# Altium schematic sheet Headers.SchDoc
size B; SheetNumber: 3; SheetTotal: 3
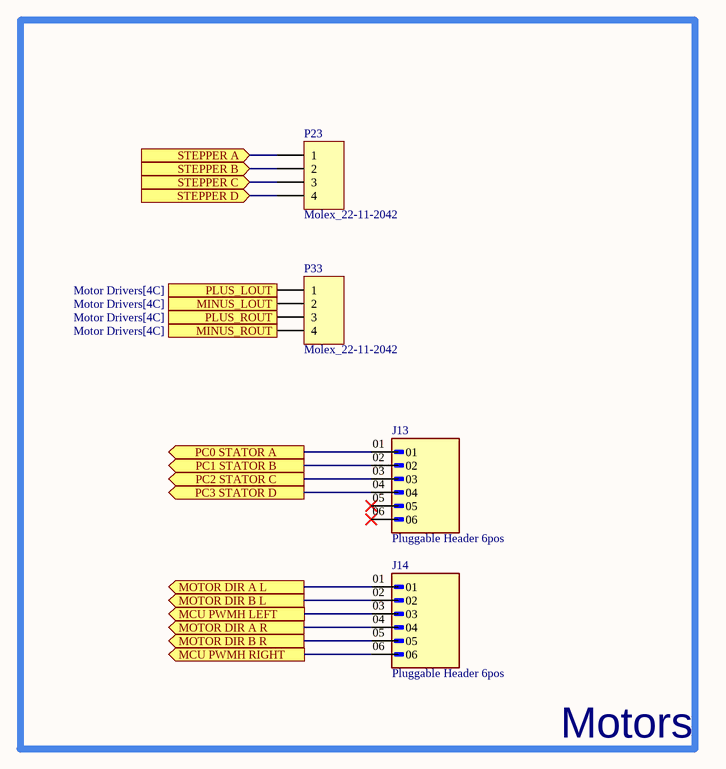
[diagram p0: Headers.SchDoc]

## Parts
J13  Pluggable Header 6pos  [PHOENIX_1757284]
J14  Pluggable Header 6pos  [PHOENIX_1757284]
P23  Molex_22-11-2042  [MOLEX-22-11-2042]
P33  Molex_22-11-2042  [MOLEX-22-11-2042]

## Blocks framed on the sheet
Motors: J13 J14 P23 P33

## Ports
MCU PWMH LEFT (out, see Motor Drivers[1C]), MCU PWMH RIGHT (out, see Motor Drivers[1C]), MINUS_LOUT (in, see Motor Drivers[4C]), MINUS_ROUT (in, see Motor Drivers[4C]), MOTOR DIR A L (out, see Motor Drivers[1C]), MOTOR DIR A R (out, see Motor Drivers[1C]), MOTOR DIR B L (out, see Motor Drivers[1C]), MOTOR DIR B R (out, see Motor Drivers[1C]), PC0 STATOR A (out, see Motor Drivers[1A]), PC1 STATOR B (out, see Motor Drivers[1A]), PC2 STATOR C (out, see Motor Drivers[1A]), PC3 STATOR D (out, see Motor Drivers[1A]), PLUS_LOUT (in, see Motor Drivers[4C]), PLUS_ROUT (in, see Motor Drivers[4C]), STEPPER A (in, see Motor Drivers[3A]), STEPPER B (in, see Motor Drivers[3A]), STEPPER C (in, see Motor Drivers[3A]), STEPPER D (in, see Motor Drivers[3A])

## Nets
MCU PWMH LEFT: J14.03 ; port MCU PWMH LEFT
MCU PWMH RIGHT: J14.06 ; port MCU PWMH RIGHT
MINUS_LOUT: P33.2 ; port MINUS_LOUT
MINUS_ROUT: P33.4 ; port MINUS_ROUT
MOTOR DIR A L: J14.01 ; port MOTOR DIR A L
MOTOR DIR A R: J14.04 ; port MOTOR DIR A R
MOTOR DIR B L: J14.02 ; port MOTOR DIR B L
MOTOR DIR B R: J14.05 ; port MOTOR DIR B R
PC0 STATOR A: J13.01 ; port PC0 STATOR A
PC1 STATOR B: J13.02 ; port PC1 STATOR B
PC2 STATOR C: J13.03 ; port PC2 STATOR C
PC3 STATOR D: J13.04 ; port PC3 STATOR D
PLUS_LOUT: P33.1 ; port PLUS_LOUT
PLUS_ROUT: P33.3 ; port PLUS_ROUT
STEPPER A: P23.1 ; port STEPPER A
STEPPER B: P23.2 ; port STEPPER B
STEPPER C: P23.3 ; port STEPPER C
STEPPER D: P23.4 ; port STEPPER D

Not connected (* = marked no-connect by the designer): J13 05* 06*

## Notes on the sheet
- ESE
- is the sole property of ESE. Any reproduction
- The Information Contained in this drawing
- Schematic P/N and Name
- Sheet Name
- 850 Fountain St. S.
- Cambridge, ON N3H 0A8
- Canada
- Approved
- in part or in whole without the written
- permission of ESE is strictly prohibited.
- APPROVALS
- DATE
- Size
- Scale
- B
- NTS
- Bare PCB P/N
- Date
- Sheet
- Rev.
- Checked
- Created
- of

## Library data of the parts
J13 J14 = Pluggable Header 6pos: Pluggable Header 5.08mm 12AWG 320V 12A 6 Position COMBICON MSTBA Series | Phoenix Contact 1757284; SnapEDA_Link: https://www.snapeda.com/parts/1757284/Phoenix+Contact/view-part/?ref=snap; Package: None; Value: *; MF: Phoenix Contact; MP: 1757284; Check_prices: https://www.snapeda.com/parts/1757284/Phoenix+Contact/view-part/?ref=eda
P23 P33 = Molex_22-11-2042: CONN HEADER 4POS .100 VERT GOLD; MPN: 0022112042; PN: WM2702-ND; URL: http://www.digikey.ca/product-detail/en/0022112042/WM2702-ND